# Altium schematic sheet PowerSupplyAndUSB.SchDoc
size A4; SheetNumber: 2; SheetTotal: 2
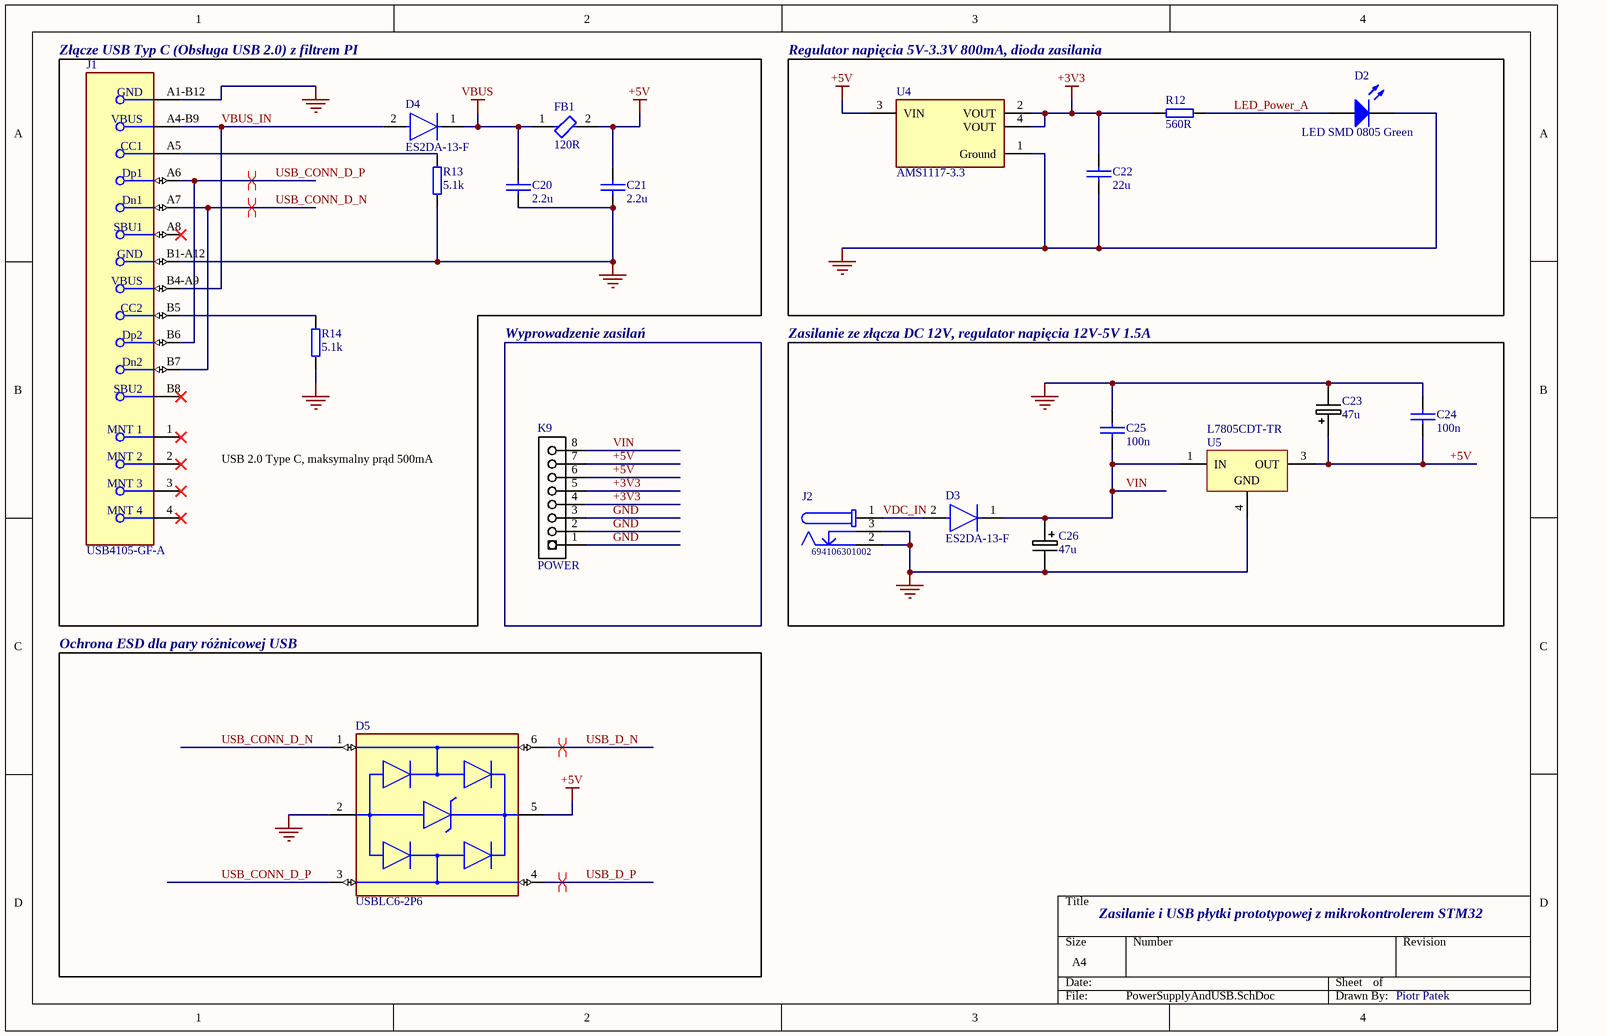
[diagram p0: PowerSupplyAndUSB.SchDoc]

## Parts
C20  2.2u  [0805]
C21  2.2u  [0805]
C22  22u  [0805]
C23  47u  [PANACAP-C]
C24  100n  [0805]
C25  100n  [0805]
C26  47u  [PANACAP-C]
D2  LED SMD 0805 Green  [0805_PAD]
D3  ES2DA-13-F  [FP-SMA-MFG]
D4  ES2DA-13-F  [FP-SMA-MFG]
D5  USBLC6-2P6  [FP-SOT-666-MFG]
FB1  120R  [FP-BLM18-0_15-t0_8-MFG]
J1  USB4105-GF-A  [FP-USB4105-GF-A-MFG]
J2  694106301002  [694106301002]
K9  POWER  [HEADER-1X8]
R12  560R  [0805]
R13  5.1k  [0805]
R14  5.1k  [0805]
U4  AMS1117-3.3  [FP-AMS1117-IPC_C]
U5  L7805CDT-TR  [TO-252_N]

## Blocks framed on the sheet
Złącze USB Typ C (Obsługa USB 2.0) z filtrem PI: C20 C21 D4 FB1 J1 R13 R14
Regulator napięcia 5V-3.3V 800mA, dioda zasilania: C22 D2 R12 U4
Zasilanie ze złącza DC 12V, regulator napięcia 12V-5V 1.5A: C23-C26 D3 J2 U5
Ochrona ESD dla pary różnicowej USB: D5

## Nets
+3V3: C22.2 K9.4 K9.5 R12.2 U4.2(VOUT) U4.4(VOUT)
+5V: C21.2 C23.+ C24.1 D5.5(VBUS) FB1.2 K9.6 K9.7 U4.3(VIN) U5.3(OUT)
GND: C20.1 C21.1 C22.1 C23.- C24.2 C25.2 C26.- D2.1(K) D5.2(GND) J1.A1-B12(GND) J1.B1-A12(GND) J2.2 J2.3 K9.1 K9.2 K9.3 R13.1 R14.1 U4.1(Ground) U5.4(GND)
VBUS: C20.2 D4.1(C) FB1.1
LED_Power_A: D2.2(A) R12.1
USB_CONN_D_N: D5.1(I/O1) J1.A7(Dn1) J1.B7(Dn2)
USB_CONN_D_P: D5.3(I/O2) J1.A6(Dp1) J1.B6(Dp2)
USB_D_N: D5.6(I/O1)
USB_D_P: D5.4(I/O2)
VBUS_IN: D4.2(A) J1.A4-B9(VBUS) J1.B4-A9(VBUS)
VDC_IN: D3.2(A) J2.1
VIN: C25.1 C26.+ D3.1(C) K9.8 U5.1(IN)
NetJ1_A5: J1.A5(CC1) R13.2
NetJ1_B5: J1.B5(CC2) R14.2

Not connected (* = marked no-connect by the designer): J1 1(MNT_1)* 2(MNT_2)* 3(MNT_3)* 4(MNT_4)* A8(SBU1)* B8(SBU2)*

## Layout directives
differential pair: USB_CONN_D_N, USB_CONN_D_P, USB_D_N, USB_D_P

## Notes on the sheet
- Wyprowadzenie zasilań
- USB 2.0 Type C, maksymalny prąd 500mA
- Zasilanie i USB płytki prototypowej z mikrokontrolerem STM32
- Piotr Patek

## Library data of the parts
C20-C22 C24 C25 = Kondensator
C23 C26 = C+47U-6V3: GENERIC CAPACITOR POLARISED; Supplier 1: Digi-Key; Supplier Part Number 1: PCE4375TR-ND
D2 = LED SMD 0805 Green: WURTH ELEKTRONIK - 150080GS75000 - LED, Green, SMD, 0805, 30 mA, 3.2 V, 520 nm; Manufacturer: Wurth Electronics; Lens Color: Colorless; Viewing Angle: 140°; Lens Style: Clear,Flat,Rectangular; Luminous Intensity: 450mcd; Forward Voltage: 3.2V; Wavelength: 520nm; Forward Current: 30mA; Test Current: 20mA; Lens Transparency: Clear; Lens Size: 1.25mm; Supplier 1: Rs; Manufacturer Part Number: 150080GS75000; RoHS: Yes; Category: LEDs; Stock 1: 31800; Mounting Technology: Surface Mount; Case/Package: 0805; Color: Green; Case Code (Metric): 2012; Case Code (Imperial): 0805; Min Operating Temperature: -40°C; Max Operating Temperature: 85°C; Packaging: Cut Tape; Dominant Wavelength: 520nm; Series: WL-SMCW; Package Quantity: 1; Length: 2mm; Width: 1.25mm; Height: 0.8mm; RoHS Compliant: Yes; Reach SVHC Compliant: Unknown; ComponentLink1URL: https://datasheet.ciiva.com/29563/150080gs75000-29563008.pdf?src-supplier=Digi-Key; ComponentLink1Description: https://datasheet.ciiva.com/29563/150080gs75000-29563008.pdf?src-supplier=Digi-Key; ComponentLink2URL: https://datasheet.ciiva.com/29279/759434-da-01-en-chipled-0805-w-kl-gruen-150080gs75000-29279039.pdf?src-supplier=Conrad; ComponentLink2Description: https://datasheet.ciiva.com/29279/759434-da-01-en-chipled-0805-w-kl-gruen-150080gs75000-29279039.pdf?src-supplier=Conrad
D3 D4 = CMP-12791-000014-1: DIODE GEN PURP 200V 2A SMA; Manufacturer: Diodes Inc.; Value: 25pF; Peak Reverse Current: 5uA; Max Surge Forward Current: 50A; Max Junction Temp: +150°C; Standoff Height: 0.05mm; Forward Current: 2A; Temperature Range High: +150°C; ComponentLink2Description: Datasheet; Footprint Url: https://www.diodes.com/assets/Package-Files/SMA.pdf; ComponentLink2URL: https://www.diodes.com/assets/Datasheets/ds14002.pdf; Max Repetitive Reverse Voltage: 200V; Lead Free: Yes; RoHS: TRUE; Category: Diode; Manufacturer Part Number: ES2DA-13-F; Mouser Description: Rectifiers RECTIFIER SUPER FAST "F" LEAD FREE; Temperature: -55°C to +150°C; Digikey Description: DIODE GEN PURP 200V 2A SMA; Automotive: No; Capacitance: 25pF; Device Class L1: Discrete Semiconductors; Height: 2.4mm; Reverse Voltage: 200V; Octopart: https://octopart.com/es2da-13-f-diodes+inc.-328903; Temperature Range Low: -55°C; Device Class L2: Diodes; Package: SMA; Device Class L3: Rectifier Diodes
D5 = CMP-12225-000058-1: TVS DIODE 5.25V 17V SOT666; Min Breakdown Voltage: 6V; Power Line Protection: Yes; Element Configuration: Dual; Test Current: 1mA; Working Voltage: 5V; Number of Channels: 2; Max Reverse Leakage Current: 150nA; Direction: Unidirectional; Peak Pulse Current: 5A; Number of Elements: 1; Capacitance: 3.5pF; Max Breakdown Voltage: 6V; Height: 0.6mm; Depth: 1.3mm; Contact Plating: Tin; Reverse Breakdown Voltage: 6V; REACH SVHC: No SVHC; Operating Supply Voltage: 5V; Width: 1.3mm; Max Operating Temperature: 125°C; Reverse Standoff Voltage: 5V; ESD Protection: Yes; Package Quantity: 1; Termination: SMD/SMT; Length: 1.7mm; Leakage Current: 150nA; Number of Bidirectional Channels: 2; Case/Package: SOT-666; Min Operating Temperature: -40°C; Number of Pins: 6; Clamping Voltage: 17V; Breakdown Voltage: 6V; Lead Free: Lead Free; Radiation Hardening: No; Packaging: Tape and Reel; Mount: Surface Mount; Polarity: Unidirectional
FB1 = CMP-0686-00437-3: Chip Ferrite Bead, 0603, 120Ω @ 100MHz, 0.18Ω, 25%, 800mA; Shielding: Unshielded; DC Resistance (DCR): 180mR; Max DC Current: 500mA; Number of Circuits: 1; Case/Package: 0603; Max Operating Temperature: 125°C; Termination: SMD/SMT; Series: BLM18A; Impedance: 120R; Length: 1.6mm; Tolerance: 25%; Number of Pins: 2; Packaging: Bulk; Package Quantity: 1000; RoHS Compliant: Yes; Height: 0.8mm; Current Rating: 500mA; Min Operating Temperature: -55°C; Width: 0.8mm
J1 = CMP-245163-000001-1: CONN RCPT USB2.0 TYPEC 5A; Manufacturer: GCT; Voltage Rating: 20V; Is Female: yes; Current Rating: 5/6.25/1.25/0.25A; Number Of Contacts: 16; Conn Orientation: Right Angle; Device Class L1: Connectors; Category: Conn; Lead Free: Yes; RoHS: TRUE; Temperature Range High: +85°C; Digikey Description: CONN RCPT USB2.0 TYPEC 5A; Device Class L3: unset; ComponentLink2Description: Datasheet; Manufacturer Part Number: USB4105-GF-A; Package: 0; Usb Standard: USB 2.0; Device Class L2: USB Connectors; Automotive: No; Temperature Range Low: -40°C; Height: 3.46mm; Temperature: -40°C to +85°C; Contact Material: Gold,Nickel; ComponentLink2URL: https://gct.co/files/drawings/usb4105.pdf; Octopart: https://octopart.com/usb4105-gf-a-gct-106627878
J2 = CMP-1502-00188-1: DC Power Jack Connector WR-DC, Male, Right Angled, THT, 5 A, 24 V; Manufacturer: Wurth Elektronik; Plug Inner Diameter: 2.05mm; Opening Diameter: 6.4mm; Rated Current: 5A; Plug Outer Diameter: 5.5mm; Working Voltage: 24V; Datasheet URL: http://katalog.we-online.de/em/datasheet/6941xx301002.pdf; Packaging: Bag; Manufacturer URL: http://www.we-online.de; Part Number: 694106301002; Gender: Male; Publisher: WurthElektronik; Operating Temperature: -40to85degC; Mounting Technology: THT; Package Reference: 694106301002; Orientation: RightAngled
K9 = HEADER-1X8: Supplier 1: Digi-Key; Supplier Part Number 1: S1011E-36-ND
R12-R14 = Rezystor
U4 = CMP-209535-000001-1: LDO Voltage Regulators 1A, 3.3V; Manufacturer: Advanced Monolithic Systems; Dropout Voltage: 1.1V; Output Type: Fixed; Nominal Supply Current: 5mA; Max Power Dissipation: 1.2W; Max Supply Voltage: 15V; Number Of Outputs: 1; Standoff Height: 0.64mm; Max Junction Temp: +125°C; Height: 1.8mm; Package: AMS1117; Device Class L2: Power Management ICs; ComponentLink2Description: Datasheet; ComponentLink2URL: http://www.advanced-monolithic.com/pdf/ds1117.pdf; Category: IC; RoHS: TRUE; Automotive: No; Device Class L1: Integrated Circuits (ICs); Output Current: 1A; Device Class L3: Voltage Regulators - Linear; Temperature: -40°C to +125°C; Output Voltage: 3.3V; Manufacturer Part Number: AMS1117-3.3; Temperature Range Low: -40°C; Octopart: https://octopart.com/ams1117-3.3-advanced+monolithic+systems-25899300; Lead Free: Yes; Ipc Land Pattern Name: SOT229P700X180-4; Temperature Range High: +125°C
U5 = CMP-0244-00216-1: Positive Voltage Regulator, 3-Pin DPAK, Tape and Reel; PackageVersion: 2011; PackageReference: TO-252; DatasheetVersion: 16/11/2011; PackageDescription: 3-Pin Transistor Outline Package 2.28 mm Pitch, 9.7 mm Lead Span (DPAK); ComponentLink1URL: http://www.st.com; ComponentLink2Description: Datasheet; ComponentLink1Description: Manufacturer URL; ComponentLink2URL: http://www.st.com/internet/com/TECHNICAL_RESOURCES/TECHNICAL_LITERATURE/DATASHEET/CD00000444.pdf